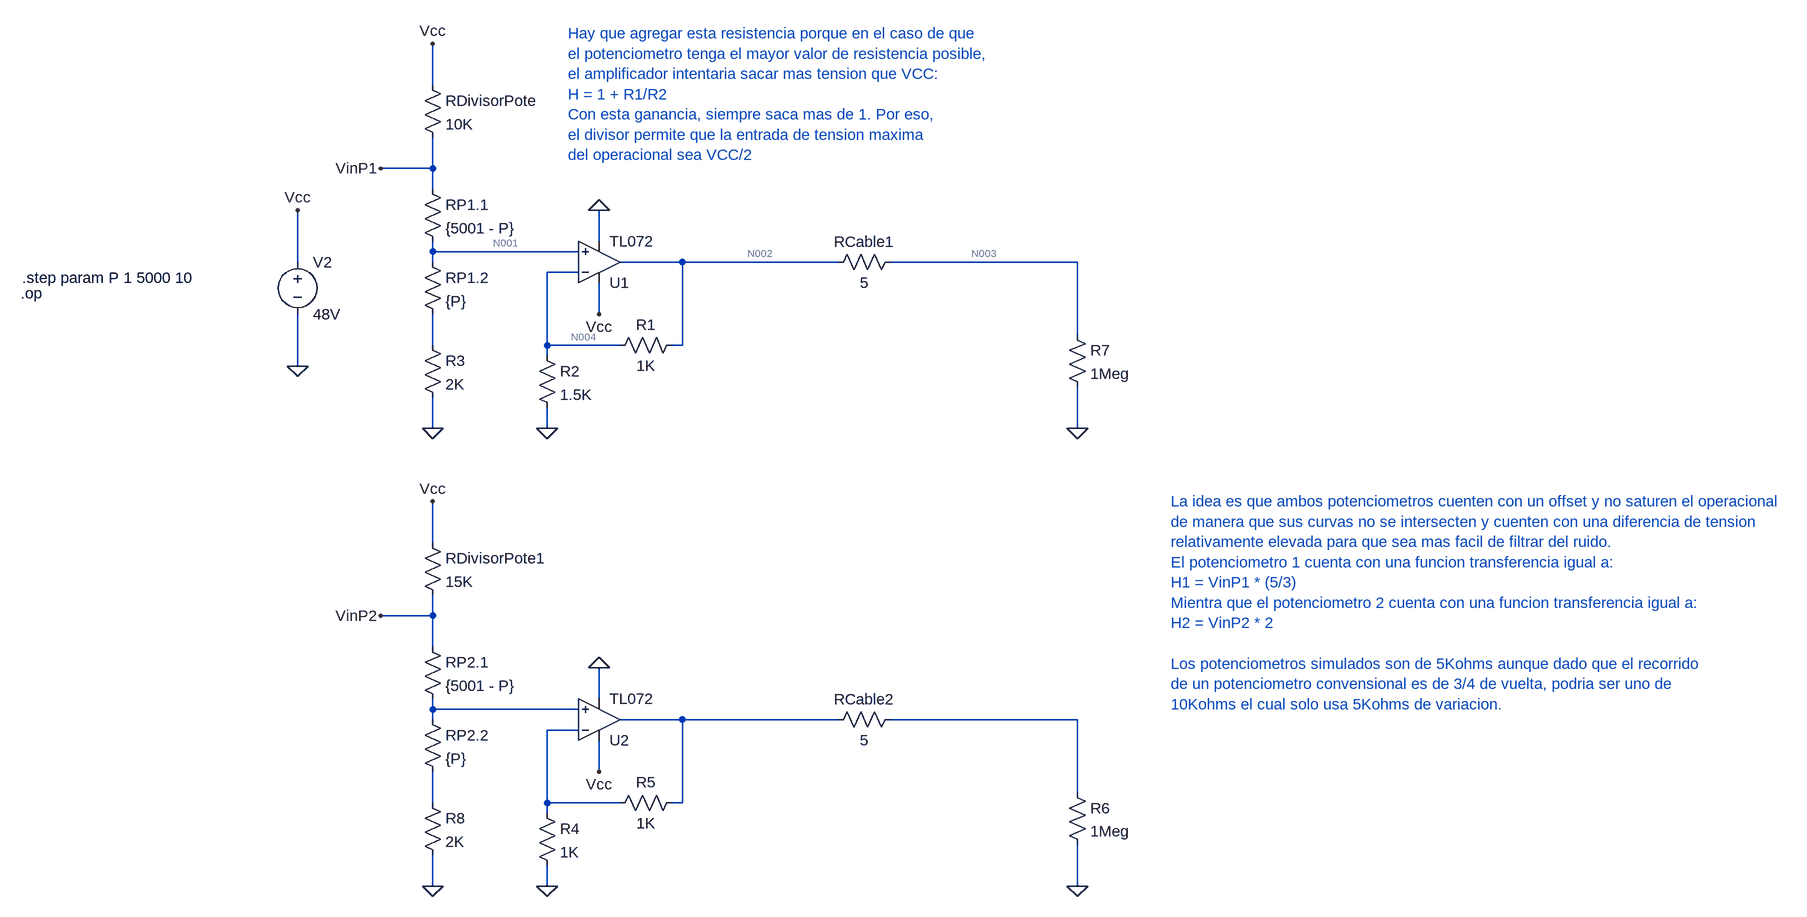
[diagram p0: schematic APPS Transfer Funtions.asc]
APPS Transfer Funtions.asc, the LTspice schematic file:
Version 4
SHEET 1 1868 804
WIRE -368 -448 -368 -512
WIRE -368 -320 -368 -368
WIRE -368 -320 -448 -320
WIRE -368 -288 -368 -320
WIRE -112 -208 -112 -256
WIRE -368 -192 -368 -208
WIRE -144 -192 -368 -192
WIRE -576 -176 -576 -256
WIRE -368 -176 -368 -192
WIRE 16 -176 -80 -176
WIRE 256 -176 16 -176
WIRE 624 -176 336 -176
WIRE -144 -160 -192 -160
WIRE -112 -96 -112 -144
WIRE 624 -64 624 -176
WIRE -368 -48 -368 -96
WIRE -192 -48 -192 -160
WIRE -80 -48 -192 -48
WIRE 16 -48 16 -176
WIRE 16 -48 0 -48
WIRE -192 -32 -192 -48
WIRE -576 -16 -576 -96
WIRE -368 80 -368 32
WIRE -192 80 -192 48
WIRE 624 80 624 16
WIRE -368 256 -368 192
WIRE -368 368 -368 336
WIRE -368 368 -448 368
WIRE -368 416 -368 368
WIRE -112 496 -112 448
WIRE -368 512 -368 496
WIRE -144 512 -368 512
WIRE -368 528 -368 512
WIRE 16 528 -80 528
WIRE 256 528 16 528
WIRE 624 528 336 528
WIRE -144 544 -192 544
WIRE -112 608 -112 560
WIRE 624 640 624 528
WIRE -368 656 -368 608
WIRE -192 656 -192 544
WIRE -80 656 -192 656
WIRE 16 656 16 528
WIRE 16 656 0 656
WIRE -192 672 -192 656
WIRE -368 784 -368 736
WIRE -192 784 -192 752
WIRE 624 784 624 720
FLAG -368 80 0
FLAG -112 -96 Vcc
FLAG -112 -256 0
FLAG -192 80 0
FLAG -576 -256 Vcc
FLAG -576 -16 0
FLAG 624 80 0
FLAG -368 -512 Vcc
FLAG -368 784 0
FLAG -112 608 Vcc
FLAG -112 448 0
FLAG -192 784 0
FLAG 624 784 0
FLAG -368 192 Vcc
FLAG -448 -320 VinP1
FLAG -448 368 VinP2
SYMBOL res -384 -192 R0
SYMATTR InstName RP1.2
SYMATTR Value {P}
SYMBOL res -384 -304 R0
SYMATTR InstName RP1.1
SYMATTR Value {5001 - P}
SYMBOL res -208 -48 R0
SYMATTR InstName R2
SYMATTR Value 1.5K
SYMBOL res 16 -64 R90
WINDOW 0 0 56 VBottom 2
WINDOW 3 32 56 VTop 2
SYMATTR InstName R1
SYMATTR Value 1K
SYMBOL voltage -576 -192 R0
WINDOW 123 0 0 Left 0
WINDOW 39 0 0 Left 0
SYMATTR InstName V2
SYMATTR Value 48V
SYMBOL res 352 -192 R90
WINDOW 0 0 56 VBottom 2
WINDOW 3 32 56 VTop 2
SYMATTR InstName RCable1
SYMATTR Value 5
SYMBOL res 608 -80 R0
SYMATTR InstName R7
SYMATTR Value 1Meg
SYMBOL res -384 -464 R0
SYMATTR InstName RDivisorPote
SYMATTR Value 10K
SYMBOL OpAmps\\TL072 -112 -112 M180
SYMATTR InstName U1
SYMBOL res -384 -64 R0
SYMATTR InstName R3
SYMATTR Value 2K
SYMBOL res -384 512 R0
SYMATTR InstName RP2.2
SYMATTR Value {P}
SYMBOL res -384 400 R0
SYMATTR InstName RP2.1
SYMATTR Value {5001 - P}
SYMBOL res -208 656 R0
SYMATTR InstName R4
SYMATTR Value 1K
SYMBOL res 16 640 R90
WINDOW 0 0 56 VBottom 2
WINDOW 3 32 56 VTop 2
SYMATTR InstName R5
SYMATTR Value 1K
SYMBOL res 352 512 R90
WINDOW 0 0 56 VBottom 2
WINDOW 3 32 56 VTop 2
SYMATTR InstName RCable2
SYMATTR Value 5
SYMBOL res 608 624 R0
SYMATTR InstName R6
SYMATTR Value 1Meg
SYMBOL res -384 240 R0
SYMATTR InstName RDivisorPote1
SYMATTR Value 15K
SYMBOL OpAmps\\TL072 -112 592 M180
SYMATTR InstName U2
SYMBOL res -384 640 R0
SYMATTR InstName R8
SYMATTR Value 2K
TEXT -160 -528 Left 2 ;Hay que agregar esta resistencia porque en el caso de que \nel potenciometro tenga el mayor valor de resistencia posible, \nel amplificador intentaria sacar mas tension que VCC:\nH = 1 + R1/R2\nCon esta ganancia, siempre saca mas de 1. Por eso,\nel divisor permite que la entrada de tension maxima\ndel operacional sea VCC/2
TEXT -1002 -128 Left 2 !.op
TEXT -1000 -152 Left 2 !.step param P 1 5000 10
TEXT 768 192 Left 2 ;La idea es que ambos potenciometros cuenten con un offset y no saturen el operacional\nde manera que sus curvas no se intersecten y cuenten con una diferencia de tension\nrelativamente elevada para que sea mas facil de filtrar del ruido.\nEl potenciometro 1 cuenta con una funcion transferencia igual a:\nH1 = VinP1 * (5/3)\nMientra que el potenciometro 2 cuenta con una funcion transferencia igual a:\nH2 = VinP2 * 2\n \nLos potenciometros simulados son de 5Kohms aunque dado que el recorrido\nde un potenciometro convensional es de 3/4 de vuelta, podria ser uno de\n10Kohms el cual solo usa 5Kohms de variacion.

The netlist it stands for:
* APPS Transfer Funtions.asc
RP1.2 N001 N005 {P}
RP1.1 VinP1 N001 {5001 - P}
R2 N004 0 1.5K
R1 N002 N004 1K
V2 Vcc 0 48V
RCable1 N003 N002 5
R7 N003 0 1Meg
RDivisorPote Vcc VinP1 10K
XU1 N001 N004 Vcc 0 N002 TL072  ; pins In+ In- V+ V- OUT
R3 N005 0 2K
RP2.2 N006 N010 {P}
RP2.1 VinP2 N006 {5001 - P}
R4 N009 0 1K
R5 N007 N009 1K
RCable2 N008 N007 5
R6 N008 0 1Meg
RDivisorPote1 Vcc VinP2 15K
XU2 N006 N009 Vcc 0 N007 TL072  ; pins In+ In- V+ V- OUT
R8 N010 0 2K
* Hay que agregar esta resistencia porque en el caso de que
* el potenciometro tenga el mayor valor de resistencia posible,
* el amplificador intentaria sacar mas tension que VCC:
* H = 1 + R1/R2
* Con esta ganancia, siempre saca mas de 1. Por eso,
* el divisor permite que la entrada de tension maxima
* del operacional sea VCC/2
.op
.step param P 1 5000 10
* La idea es que ambos potenciometros cuenten con un offset y no saturen el operacional
* de manera que sus curvas no se intersecten y cuenten con una diferencia de tension
* relativamente elevada para que sea mas facil de filtrar del ruido.
* El potenciometro 1 cuenta con una funcion transferencia igual a:
* H1 = VinP1 * (5/3)
* Mientra que el potenciometro 2 cuenta con una funcion transferencia igual a:
* H2 = VinP2 * 2
* Los potenciometros simulados son de 5Kohms aunque dado que el recorrido
* de un potenciometro convensional es de 3/4 de vuelta, podria ser uno de
* 10Kohms el cual solo usa 5Kohms de variacion.
.backanno
.end

* Results of the author's LTspice run, read from the files saved beside the schematic
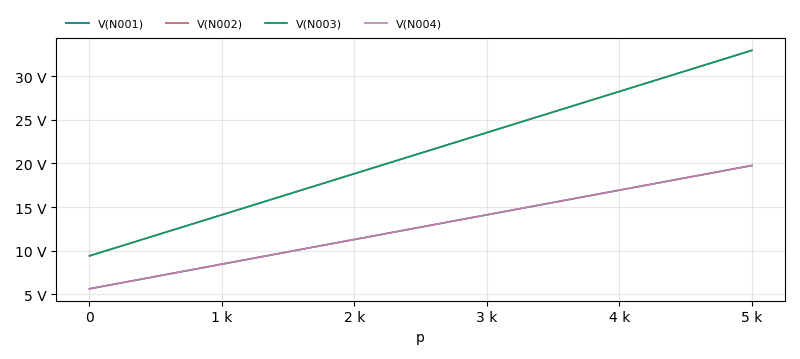
[diagram p1: Operating Point of APPS Transfer Funtions.asc, plotted from the saved traces]
* Operating Point, 1 run:
*   V(N001): 5.65 V at p=1 , 19.76 V at p=5 k, min 5.65 V, max 19.76 V
*   V(N002): 9.417 V at p=1 , 32.94 V at p=5 k, min 9.417 V, max 32.94 V
*   V(N003): 9.417 V at p=1 , 32.94 V at p=5 k, min 9.417 V, max 32.94 V
*   V(N004): 5.65 V at p=1 , 19.76 V at p=5 k, min 5.65 V, max 19.76 V
* From the log:
*   Semiconductor Device Operating Points:
*                           --- Diodes ---
*   Name:    d:u2:p      d:u2:ln     d:u2:lp     d:u2:e      d:u2:c
*   Model:    u2:dx       u2:dx       u2:dx       u2:dx       u2:dx
*   Id:     -4.80e-11   -2.94e-11   -2.06e-11   -6.53e-12   -3.71e-11
*   Vd:     -4.80e+01   -2.94e+01   -2.06e+01   -6.53e+00   -3.71e+01
*   Req:     1.00e+12    1.00e+12    1.00e+12    1.00e+12    1.00e+12
*   CAP:     0.00e+00    0.00e+00    0.00e+00    0.00e+00    0.00e+00
*   Name:    d:u1:p      d:u1:ln     d:u1:lp     d:u1:e      d:u1:c
*   Model:    u1:dx       u1:dx       u1:dx       u1:dx       u1:dx
*   Id:     -4.80e-11   -2.88e-11   -2.12e-11   -7.22e-12   -3.64e-11
*   Vd:     -4.80e+01   -2.88e+01   -2.12e+01   -7.22e+00   -3.64e+01
*   Req:     1.00e+12    1.00e+12    1.00e+12    1.00e+12    1.00e+12
*   CAP:     0.00e+00    0.00e+00    0.00e+00    0.00e+00    0.00e+00
*                           --- JFET Transistors ---
*   Name:    j:u2:2      j:u2:1      j:u1:2      j:u1:1
*   Model:    u2:jx       u2:jx       u1:jx       u1:jx
*   Id:     -1.07e-04   -1.07e-04   -1.07e-04   -1.07e-04
*   Vgs:     3.70e-01    3.70e-01    3.71e-01    3.72e-01
*   Vds:    -3.62e+00   -3.62e+00   -4.90e+00   -4.90e+00
*   Gm:      3.41e-04    3.40e-04    3.40e-04    3.39e-04
*   Gds:     0.00e+00    0.00e+00    0.00e+00    0.00e+00
*   Cgs:     0.00e+00    0.00e+00    0.00e+00    0.00e+00
*   Cgd:     0.00e+00    0.00e+00    0.00e+00    0.00e+00